# Altium schematic sheet TC377TP_1.SchDoc
size A4; SheetNumber: 4; SheetTotal: 5
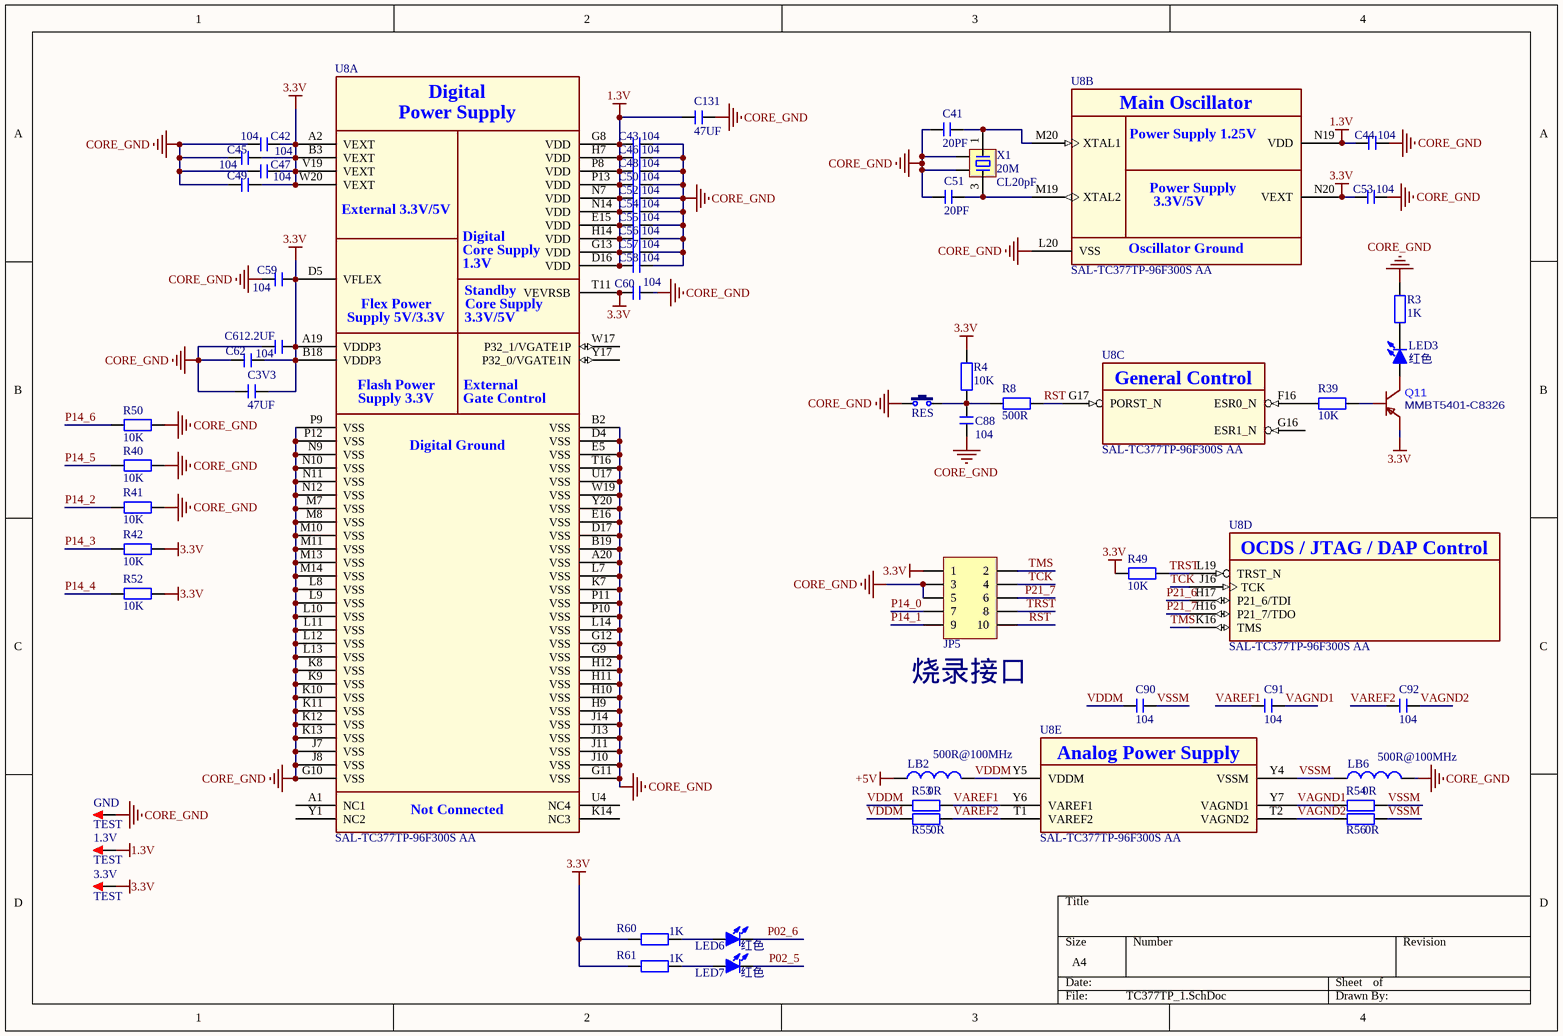
[diagram p0: TC377TP_1.SchDoc]

## Parts
1.3V  TEST  [TEST 1.6]
3.3V  TEST  [TEST 1.6]
C3V3  47UF  [C 0805_L]
C41  20PF  [C 0603_L]
C42  104  [C 0603_L]
C43  104  [C 0603_L]
C44  104  [C 0603_L]
C45  104  [C 0603_L]
C46  104  [C 0603_L]
C47  104  [C 0603_L]
C48  104  [C 0603_L]
C49  104  [C 0603_L]
C50  104  [C 0603_L]
C51  20PF  [C 0603_L]
C52  104  [C 0603_L]
C53  104  [C 0603_L]
C54  104  [C 0603_L]
C55  104  [C 0603_L]
C56  104  [C 0603_L]
C57  104  [C 0603_L]
C58  104  [C 0603_L]
C59  104  [C 0603_L]
C60  104  [C 0603_L]
C61  2.2UF  [C 0603_L]
C62  104  [C 0603_L]
C88  104  [C 0603_L]
C90  104  [C 0603_L]
C91  104  [C 0603_L]
C92  104  [C 0603_L]
C131  47UF  [C 0805_L]
GND  TEST  [TEST 1.6]
JP5  Header 5X2  [IDC2.54-LI-2x5P]  (value not drawn)
LB2  500R@100MHz  [FB 0603_L]
LB6  500R@100MHz  [FB 0603_L]
LED3  红色  [LED 0603Y]
LED6  红色  [LED 0603Y]
LED7  红色  [LED 0603Y]
Q11  MMBT5401-C8326  [SOT23-3L]
R3  1K  [R 0603_L]
R4  10K  [R 0603_L]
R8  500R  [R 0603_L]
R39  10K  [R 0603_L]
R40  10K  [R 0603_L]
R41  10K  [R 0603_L]
R42  10K  [R 0603_L]
R49  10K  [R 0805_L]
R50  10K  [R 0603_L]
R52  10K  [R 0603_L]
R53  0R  [R 0603_L]
R54  0R  [R 0603_L]
R55  0R  [R 0603_L]
R56  0R  [R 0603_L]
R60  1K  [R 0603_L]
R61  1K  [R 0603_L]
RES  3x6x5  [TSW SMD-3*6*2.5]  (value not drawn)
U8  SAL-TC377TP-96F300S AA  [BGA292C80P20X20]  (parts A,B,C,D,E of 13)
X1  20M  负载电容: CL20pF  [OSC 3225-4P]

## Nets
1.3V: 1.3V.1 C43.2 C44.2 C46.2 C48.2 C50.2 C52.2 C54.2 C55.2 C56.2 C57.2 C58.2 C131.2 U8.D16(VDD) U8.E15(VDD) U8.G8(VDD) U8.G13(VDD) U8.H7(VDD) U8.H14(VDD) U8.N7(VDD) U8.N14(VDD) U8.N19(VDD) U8.P8(VDD) U8.P13(VDD)
3.3V: 3.3V.1 C3V3.2 C42.1 C45.1 C47.1 C49.1 C53.2 C59.1 C60.2 C61.1 C62.1 JP5.1 Q11.2(E) R4.2 R42.2 R49.2 R52.2 R60.2 R61.2 U8.A2(VEXT) U8.A19(VDDP3) U8.B3(VEXT) U8.B18(VDDP3) U8.D5(VFLEX) U8.N20(VEXT) U8.T11(VEVRSB) U8.V19(VEXT) U8.W20(VEXT)
+5V: LB2.1
CORE_GND: C3V3.1 C41.2 C42.2 C43.1 C44.1 C45.2 C46.1 C47.2 C48.1 C49.2 C50.1 C51.2 C52.1 C53.1 C54.1 C55.1 C56.1 C57.1 C58.1 C59.2 C60.1 C61.2 C62.2 C88.1 C131.1 GND.1 JP5.3 JP5.5 LB6.2 R3.1 R40.2 R41.2 R50.2 RES.1 U8.A20(VSS) U8.B2(VSS) U8.B19(VSS) U8.D4(VSS) U8.D17(VSS) U8.E5(VSS) U8.E16(VSS) U8.G9(VSS) U8.G10(VSS) U8.G11(VSS) U8.G12(VSS) U8.H9(VSS) U8.H10(VSS) U8.H11(VSS) U8.H12(VSS) U8.J7(VSS) U8.J8(VSS) U8.J10(VSS) U8.J11(VSS) U8.J13(VSS) U8.J14(VSS) U8.K7(VSS) U8.K8(VSS) U8.K9(VSS) U8.K10(VSS) U8.K11(VSS) U8.K12(VSS) U8.K13(VSS) U8.L7(VSS) U8.L8(VSS) U8.L9(VSS) U8.L10(VSS) U8.L11(VSS) U8.L12(VSS) U8.L13(VSS) U8.L14(VSS) U8.L20(VSS) U8.M7(VSS) U8.M8(VSS) U8.M10(VSS) U8.M11(VSS) U8.M13(VSS) U8.M14(VSS) U8.N9(VSS) U8.N10(VSS) U8.N11(VSS) U8.N12(VSS) U8.P9(VSS) U8.P10(VSS) U8.P11(VSS) U8.P12(VSS) U8.T16(VSS) U8.U17(VSS) U8.W19(VSS) U8.Y20(VSS) X1.2 X1.4
P02_5: LED7.2(K)
P02_6: LED6.2(K)
P14_0: JP5.7
P14_1: JP5.9
P14_2: R41.1
P14_3: R42.1
P14_4: R52.1
P14_5: R40.1
P14_6: R50.1
P21_6: U8.H17(P21_6/TDI)
P21_7: JP5.6 U8.H16(P21_7/TDO)
RST: JP5.10 R8.2 U8.G17(PORST_N)
TCK: JP5.4 U8.J16(TCK)
TMS: JP5.2 U8.K16(TMS)
TRST: JP5.8 R49.1 U8.L19(TRST_N)
VAGND1: C91.1 R54.1 U8.Y7(VAGND1)
VAGND2: C92.1 R56.1 U8.T2(VAGND2)
VAREF1: C91.2 R53.2 U8.Y6(VAREF1)
VAREF2: C92.2 R55.2 U8.T1(VAREF2)
VDDM: C90.2 LB2.2 R53.1 R55.1 U8.Y5(VDDM)
VSSM: C90.1 LB6.1 R54.2 R56.2 U8.Y4(VSSM)
NetC41_1: C41.1 U8.M20(XTAL1) X1.1
NetC51_1: C51.1 U8.M19(XTAL2) X1.3
NetC88_2: C88.2 R4.1 R8.1 RES.2
NetLED3_1: LED3.1(A) Q11.3(C)
NetLED3_2: LED3.2(K) R3.2
NetLED6_1: LED6.1(A) R60.1
NetLED7_1: LED7.1(A) R61.1
NetQ11_1: Q11.1(B) R39.1
NetR39_2: R39.2 U8.F16(ESR0_N)

Not connected (* = marked no-connect by the designer): U8 A1(NC1) G16(ESR1_N) K14(NC3) U4(NC4) W17(P32_1/VGATE1P) Y1(NC2) Y17(P32_0/VGATE1N)

## Notes on the sheet
- (near JP5) 烧录接口
- (in symbol SAL-TC377TP-96F300S AA, part A) Digital; Power Supply; External 3.3V/5V; Core Supply; 1.3V; Standby; Flex Power; Supply 5V/3.3V; 3.3V/5V; Flash Power; External; Supply 3.3V; Gate Control; Digital Ground; Not Connected
- (in symbol SAL-TC377TP-96F300S AA, part B) Main Oscillator; Power Supply 1.25V; Power Supply; 3.3V/5V; Oscillator Ground
- (in symbol SAL-TC377TP-96F300S AA, part C) General Control
- (in symbol SAL-TC377TP-96F300S AA, part D) OCDS / JTAG / DAP Control
- (in symbol SAL-TC377TP-96F300S AA, part E) Analog Power Supply

## Library data of the parts
1.3V 3.3V GND = TEST: 测试点; 版权归属: 源创客; BOM名称: 测试点; 学习资源: www.ooocke.com
C3V3 C41-C62 C88 C90-C92 C131 = C: 无极性贴片电容; 版权归属: 源创客; 材质: X7R; BOM名称: 无极性贴片电容; 学习资源: www.ooocke.com
JP5 = Header 5X2: 5*2P接插件; 版权归属: 源创客; BOM名称: 5*2P接插件; 学习资源: www.ooocke.com
LB2 LB6 = LB: 磁珠; 版权归属: 源创客; BOM名称: 磁珠; 学习资源: www.ooocke.com
LED3 LED6 LED7 = LED-SMD: 贴片LED; 版权归属: 源创客; BOM名称: 贴片LED; 学习资源: www.ooocke.com
R3 R4 R8 R39-R42 R49 R50 R52-R56 R60 R61 = R: 贴片电阻; 版权归属: 源创客; BOM名称: 贴片电阻; 学习资源: www.ooocke.com
RES = TSW 3x6: 3x6轻触开关; 版权归属: 源创客; BOM名称: 3x6轻触开关; 学习资源: www.ooocke.com
U8 = SAL-TC377TP-96F300S AA: 32-Bit Single-Chip Microcontroller; Manufacturer: Infineon Technologies; Manufacturer Order Number: SAL-TC377TP-96F300S AA; PackageReference: PG-LFBGA-292-11
X1 = XTAL-4P: 4脚无源晶振; 版权归属: 源创客; BOM名称: 4脚无源晶振; 学习资源: www.ooocke.com